# EAGLE design i2c_multi_8x (EAGLE 4.16)
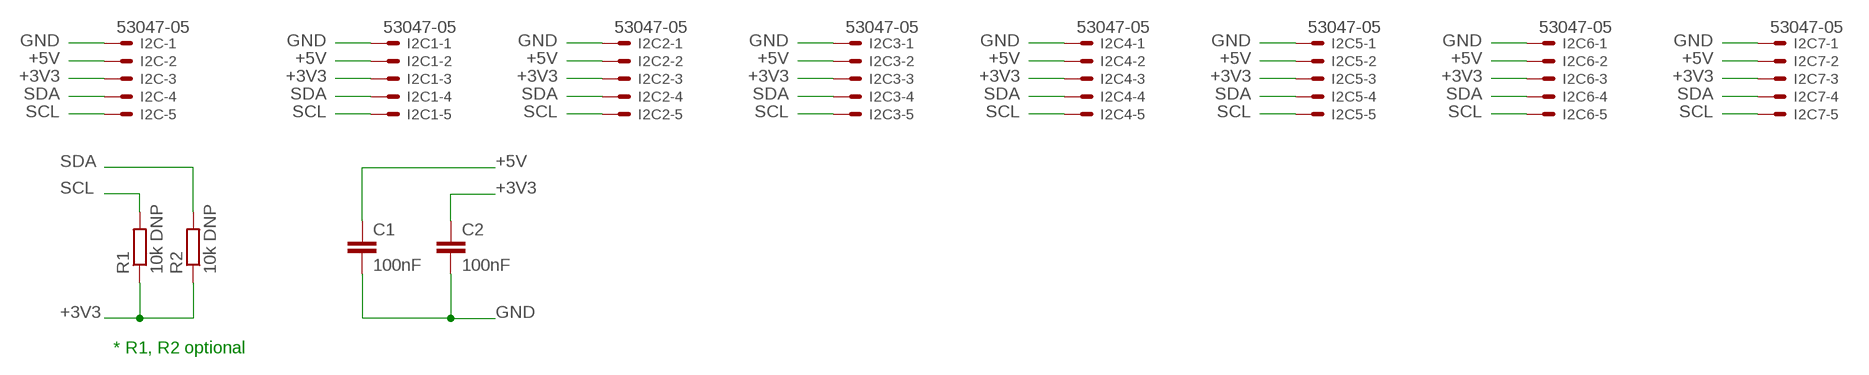
[diagram p0: schematic, sheet 1]

## Parts
C1  100nF  C-EUC0603  [C0603]
C2  100nF  C-EUC0603  [C0603]
I2C  53047-05  [53047-05]
I2C1  53047-05  [53047-05]
I2C2  53047-05  [53047-05]
I2C3  53047-05  [53047-05]
I2C4  53047-05  [53047-05]
I2C5  53047-05  [53047-05]
I2C6  53047-05  [53047-05]
I2C7  53047-05  [53047-05]
R1  10k DNP  R-EU_R0603  [R0603]
R2  10k DNP  R-EU_R0603  [R0603]

## Nets
+3V3: C2.1 I2C1.3 I2C2.3 I2C3.3 I2C4.3 I2C5.3 I2C6.3 I2C7.3 I2C.3 R1.1 R2.1
+5V: C1.1 I2C1.2 I2C2.2 I2C3.2 I2C4.2 I2C5.2 I2C6.2 I2C7.2 I2C.2
GND: C1.2 C2.2 I2C1.1 I2C2.1 I2C3.1 I2C4.1 I2C5.1 I2C6.1 I2C7.1 I2C.1
SCL: I2C1.5 I2C2.5 I2C3.5 I2C4.5 I2C5.5 I2C6.5 I2C7.5 I2C.5 R1.2
SDA: I2C1.4 I2C2.4 I2C3.4 I2C4.4 I2C5.4 I2C6.4 I2C7.4 I2C.4 R2.2

## Notes on the sheet
- * R1, R2 optional

## Library data of the parts
C1 C2 = rcl:C-EU: CAPACITOR, European symbol
I2C I2C1-I2C7 = con-molex:53?-05: CONNECTOR wire to board 1.25 mm (.049 inch) pitch header
R1 R2 = rcl:R-EU_: RESISTOR, European symbol

## Board
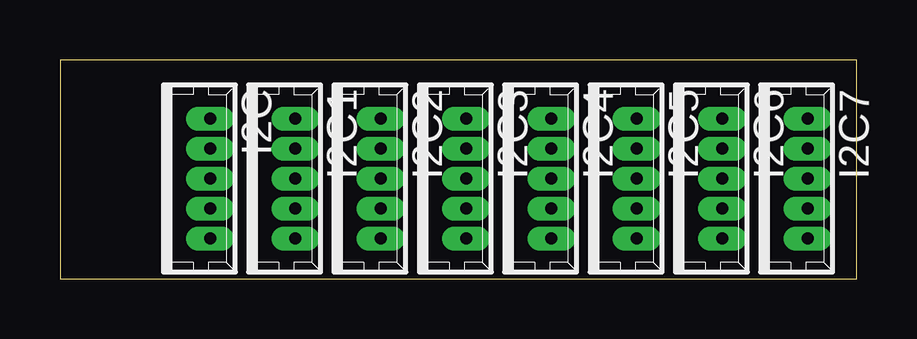
[diagram p1: board, top side]
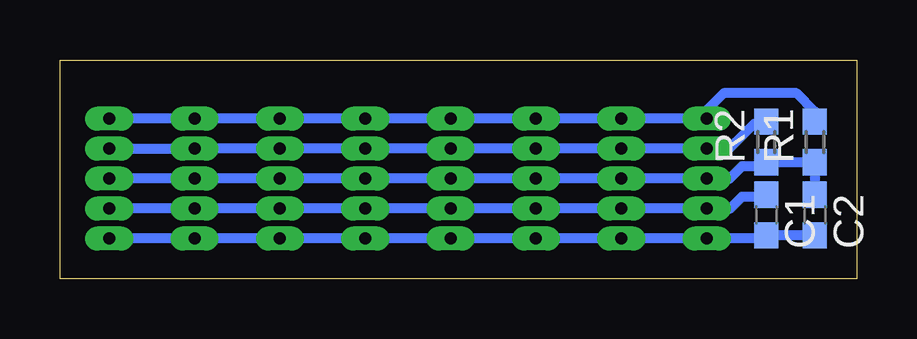
[diagram p2: board, bottom side, seen from below]

Size 33.2 x 9.13 mm. Coordinates in mm from the lower left corner, seen from the top.
Outline: 0,0 33.2,0 33.2,9.13 0,9.13 0,0
Copper layers (1*16): Top 0.035mm / dielectric 1.5mm / Bottom 0.035mm
Design rules "default": minimum track width 10mil, minimum drill 24mil, track to track 8mil, track to pad 8mil, pad to pad 8mil, via to via 8mil, smd to smd 8mil, copper to edge 40mil, drill to drill 8mil, minimum pad ring 10mil, minimum via ring 8mil, stop-mask expansion 4mil, vias tented up to drill 0mil, thermal gap 10mil

### Footprints (pad centres in the part's own frame; a part is rotated, then mirrored left to right if it is on the bottom)
C0603 = smd 1.1 x 1: 1 -0.85,0; 2 0.85,0
53047-05 = drill 0.5 pad 0.698 long: 1 2.5,0.45; 2 1.25,0.45; 3 0,0.45; 4 -1.25,0.45; 5 -2.5,0.45
R0603 = smd 1.1 x 1: 1 -0.85,0; 2 0.85,0

### Placement (x,y rotation side)
C1  3.77,2.66 270 bottom
C2  1.74,2.66 270 bottom
I2C  5.8,4.19 270 top
I2C1  9.36,4.19 270 top
I2C2  12.92,4.19 270 top
I2C3  16.47,4.19 270 top
I2C4  20.03,4.19 270 top
I2C5  23.58,4.19 270 top
I2C6  27.14,4.19 270 top
I2C7  30.7,4.19 270 top
R1  1.74,5.71 90 bottom
R2  3.77,5.71 90 bottom

### Tracks (layer width: path | path; a pad name or v marks a point on that pad's centre or on a via)
+3V3
  Bottom 0.406: 13.42,4.19 I2C3.3 I2C4.3 I2C5.3 | 13.42,4.19 I2C2.3 | 13.42,4.19 I2C1.3 I2C.3 5.3,4.19 4.79,4.69 3.77,4.69 R2.1 1.83,4.86 1.74,4.95 R1.1 C2.1 1.74,3.42 | I2C5.3 24.09,4.19 | I2C6.3 27.65,4.19 | I2C5.3 I2C6.3 | 31.2,4.19 I2C7.3 I2C6.3
+5V
  Bottom 0.406: 16.98,2.94 I2C3.2 13.42,2.94 | 16.98,2.94 I2C4.2 I2C5.2 | 16.98,2.94 16.98,2.92 | 13.42,2.94 I2C2.2 9.87,2.94 | 13.42,2.94 13.42,2.92 | 9.87,2.94 I2C1.2 6.31,2.94 | 9.87,2.94 9.87,2.92 | 6.31,2.94 I2C.2 5.28,2.94 4.79,3.42 3.77,3.42 C1.1 | 6.31,2.94 6.31,2.92 | I2C5.2 24.09,2.94 24.09,2.92 | I2C5.2 I2C6.2 | I2C6.2 27.65,2.94 27.65,2.92 | 31.2,2.94 I2C7.2 | I2C6.2 31.2,2.94 | 31.2,2.94 31.2,2.92
GND
  Bottom 0.406: 16.98,1.69 I2C3.1 13.42,1.69 | 16.98,1.69 I2C4.1 I2C5.1 | 16.98,1.69 16.98,1.65 | 13.42,1.69 I2C2.1 9.87,1.69 | 13.42,1.69 13.42,1.65 | 9.87,1.69 I2C1.1 6.31,1.69 | 9.87,1.69 9.87,1.65 | 6.31,1.69 I2C.1 3.77,1.69 | 6.31,1.69 6.31,1.65 | 3.77,1.69 C1.2 C2.2 1.74,1.65 | 3.77,1.69 3.77,1.65 | I2C5.1 24.09,1.69 24.09,1.65 | I2C5.1 I2C6.1 | I2C6.1 27.65,1.69 27.65,1.65 | 31.2,1.69 I2C7.1 | I2C6.1 31.2,1.69 | 31.2,1.69 31.2,1.65
SCL
  Bottom 0.406: I2C3.5 16.73,6.69 16.73,6.73 | I2C3.5 I2C4.5 I2C5.5 | 13.42,6.69 I2C2.5 9.87,6.69 | 13.42,6.69 I2C3.5 | 13.42,6.69 13.42,6.73 | 9.87,6.69 I2C1.5 6.31,6.69 | 9.87,6.69 9.87,6.73 | 6.31,6.69 I2C.5 6.25,7.04 5.55,7.74 2.5,7.74 1.74,6.98 R1.2 | 6.31,6.69 6.31,6.73 | I2C5.5 24.09,6.69 24.09,6.73 | I2C5.5 I2C6.5 | I2C6.5 27.65,6.69 27.65,6.73 | 31.2,6.69 I2C7.5 | I2C6.5 31.2,6.69 | 31.2,6.69 31.2,6.73
SDA
  Bottom 0.406: 16.98,5.44 I2C3.4 13.42,5.44 | 16.98,5.44 I2C4.4 I2C5.4 | 16.98,5.44 16.98,5.46 | 13.42,5.44 I2C2.4 9.87,5.44 | 13.42,5.44 13.42,5.46 | 9.87,5.44 I2C1.4 6.31,5.44 | 9.87,5.44 9.87,5.46 | 6.31,5.44 I2C.4 5.32,5.44 4.28,6.47 3.77,6.47 R2.2 | 6.31,5.44 6.31,5.46 | I2C5.4 24.09,5.44 24.09,5.46 | I2C5.4 I2C6.4 27.65,5.44 | I2C7.4 27.65,5.44 | 27.65,5.44 27.65,5.46